# EAGLE design multiboard (EAGLE 6.3)
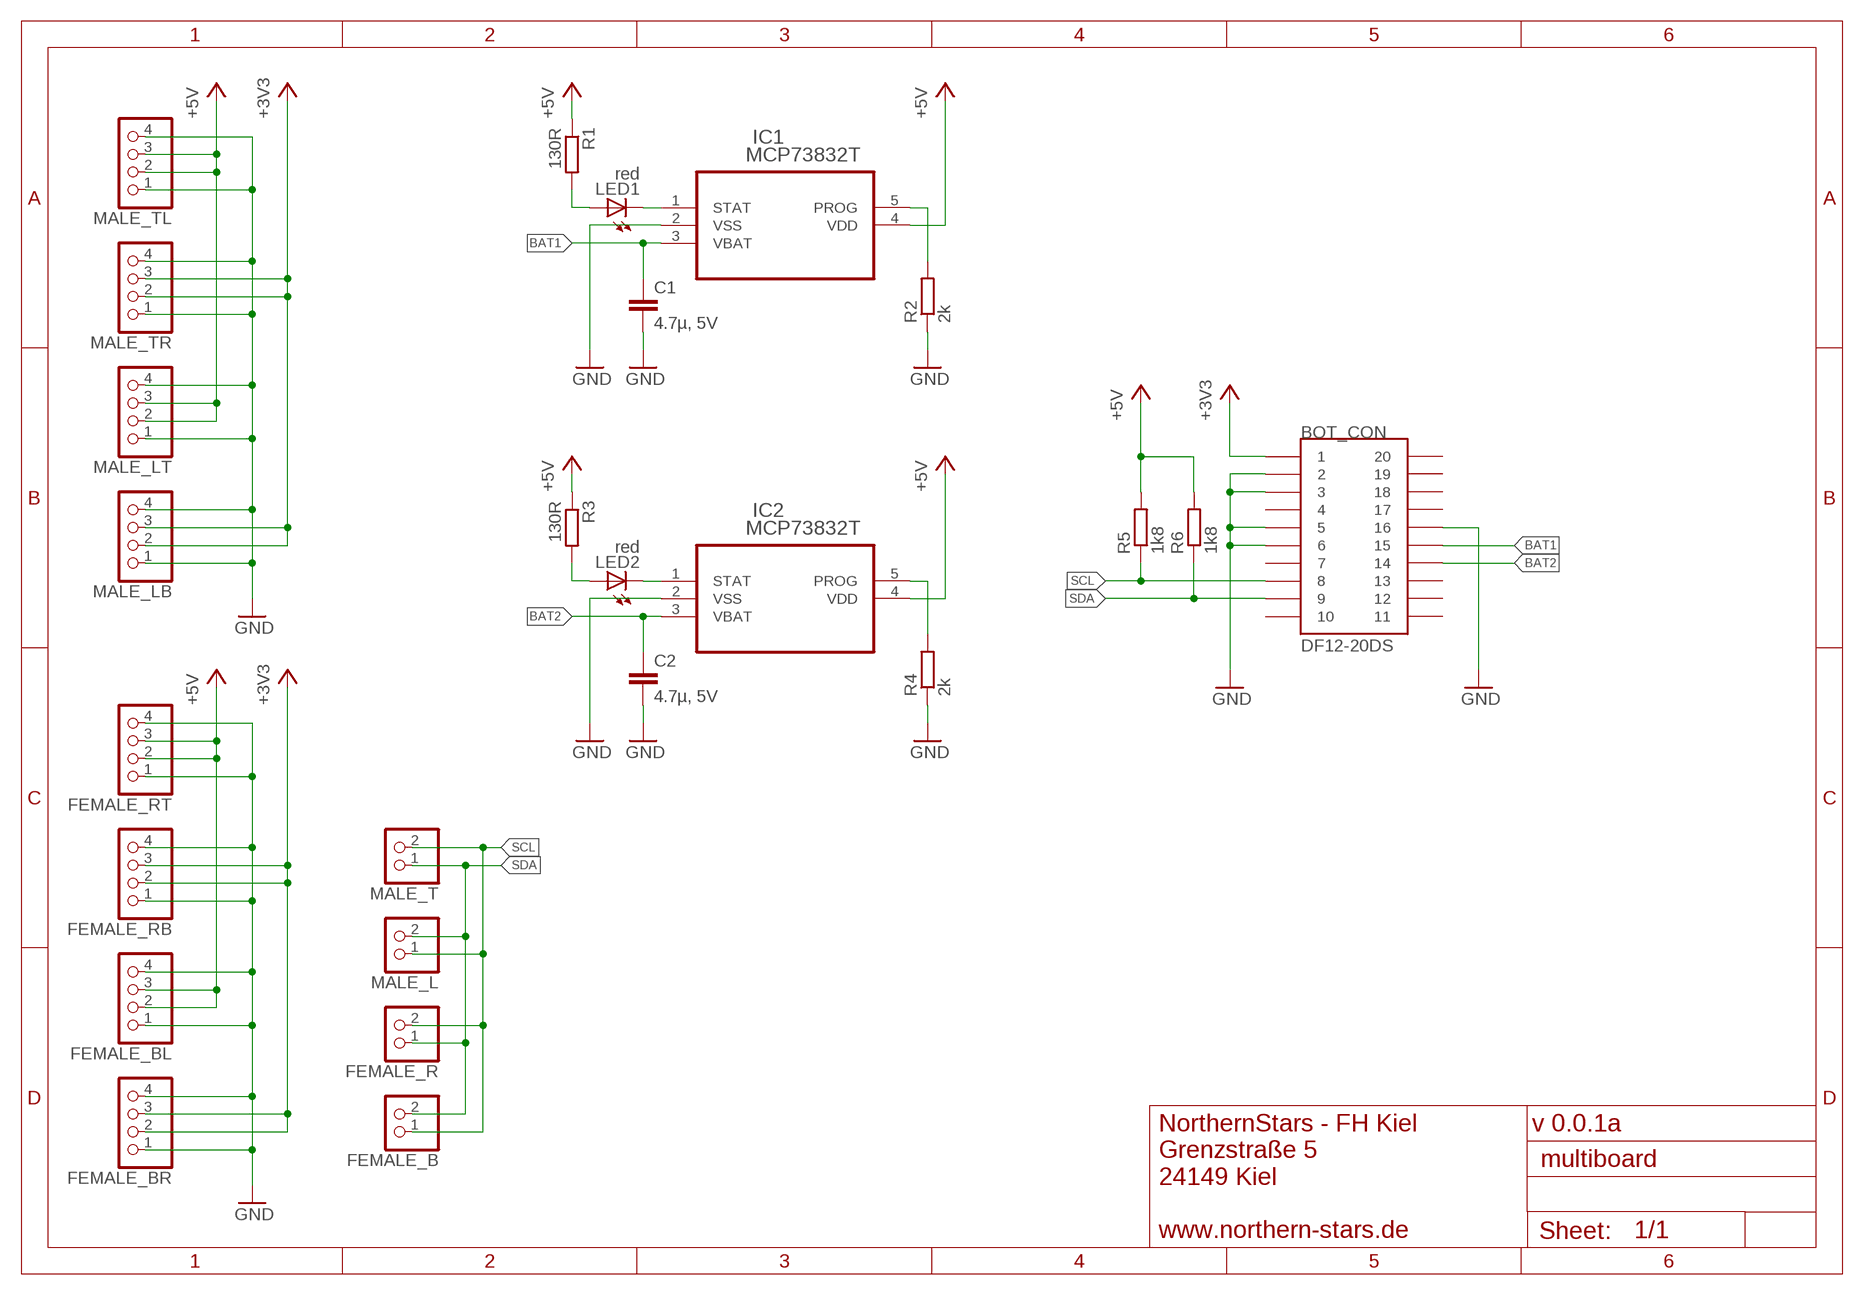
[diagram p0: schematic, sheet 1]

## Parts
BOT_CON  DF12-20DS  [DF12-20DS]
C1  4.7µ, 5V  C-EUC1206  [C1206]
C2  4.7µ, 5V  C-EUC1206  [C1206]
FEMALE_B  PINHD-1X02_2.54-SMD-90°  [1X02SMD/90]
FEMALE_BL  PINHD-1X04_2.54-SMD-90°  [1X04SMD/90]
FEMALE_BR  PINHD-1X04_2.54-SMD-90°  [1X04SMD/90]
FEMALE_R  PINHD-1X02_2.54-SMD-90°  [1X02SMD/90]
FEMALE_RB  PINHD-1X04_2.54-SMD-90°  [1X04SMD/90]
FEMALE_RT  PINHD-1X04_2.54-SMD-90°  [1X04SMD/90]
IC1  MCP73832T  MCP73832T-2DCI/OT  [SOT95P300X145-5N]
IC2  MCP73832T  MCP73832T-2DCI/OT  [SOT95P300X145-5N]
LED1  red  LEDCHIPLED_1206  [CHIPLED_1206]
LED2  red  LEDCHIPLED_1206  [CHIPLED_1206]
MALE_L  PINHD-1X02_2.54-SMD-90°  [1X02SMD/90]
MALE_LB  PINHD-1X04_2.54-SMD-90°  [1X04SMD/90]
MALE_LT  PINHD-1X04_2.54-SMD-90°  [1X04SMD/90]
MALE_T  PINHD-1X02_2.54-SMD-90°  [1X02SMD/90]
MALE_TL  PINHD-1X04_2.54-SMD-90°  [1X04SMD/90]
MALE_TR  PINHD-1X04_2.54-SMD-90°  [1X04SMD/90]
R1  130R  R-EU_R1206  [R1206]
R2  2k  R-EU_R1206  [R1206]
R3  130R  R-EU_R1206  [R1206]
R4  2k  R-EU_R1206  [R1206]
R5  1k8  R-EU_R1206  [R1206]
R6  1k8  R-EU_R1206  [R1206]

## Nets
+3V3: BOT_CON.1 FEMALE_BR.2 FEMALE_BR.3 FEMALE_RB.2 FEMALE_RB.3 MALE_LB.2 MALE_LB.3 MALE_TR.2 MALE_TR.3
+5V: FEMALE_BL.2 FEMALE_BL.3 FEMALE_RT.2 FEMALE_RT.3 IC1.4(VDD) IC2.4(VDD) MALE_LT.2 MALE_LT.3 MALE_TL.2 MALE_TL.3 R1.1 R3.1 R5.2 R6.2
BAT1: BOT_CON.15 C1.1 IC1.3(VBAT)
BAT2: BOT_CON.14 C2.1 IC2.3(VBAT)
GND: BOT_CON.2 BOT_CON.3 BOT_CON.5 BOT_CON.6 BOT_CON.16 C1.2 C2.2 FEMALE_BL.1 FEMALE_BL.4 FEMALE_BR.1 FEMALE_BR.4 FEMALE_RB.1 FEMALE_RB.4 FEMALE_RT.1 FEMALE_RT.4 IC1.2(VSS) IC2.2(VSS) MALE_LB.1 MALE_LB.4 MALE_LT.1 MALE_LT.4 MALE_TL.1 MALE_TL.4 MALE_TR.1 MALE_TR.4 R2.1 R4.1
N$1: IC1.1(STAT) LED1.C
N$2: LED1.A R1.2
N$3: IC2.1(STAT) LED2.C
N$4: IC1.5(PROG) R2.2
N$5: LED2.A R3.2
N$6: IC2.5(PROG) R4.2
SCL: BOT_CON.8 FEMALE_B.1 FEMALE_R.2 MALE_L.1 MALE_T.2 R5.1
SDA: BOT_CON.9 FEMALE_B.2 FEMALE_R.1 MALE_L.2 MALE_T.1 R6.1
Unconnected: BOT_CON.4 BOT_CON.7 BOT_CON.10 BOT_CON.11 BOT_CON.12 BOT_CON.13 BOT_CON.17 BOT_CON.18 BOT_CON.19 BOT_CON.20

## Notes on the sheet
- v 0.0.1a
- NorthernStars - FH Kiel
  Grenzstraße 5
  24149 Kiel
  
  www.northern-stars.de

## Library data of the parts
BOT_CON = con-hirose:DF12-20: HRS-Hirose DF12-Series 0.5mm Pitch SMT Board to Board Connector 20 contacts
C1 C2 = rcl:C-EU: CAPACITOR, European symbol
FEMALE_B FEMALE_R MALE_L MALE_T = pinhead-2:PINHD-1X02: PIN HEADER
FEMALE_BL FEMALE_BR FEMALE_RB FEMALE_RT MALE_LB MALE_LT MALE_TL MALE_TR = pinhead-2:PINHD-1X04: PIN HEADER
IC1 IC2 = microchip:MCP73832T-2DCI/OT: IC, BATT CHARGER, Li-Ion Li-Polymer, 500 mA; MPN: MCP73832T-2DCI/OT; OC_FARNELL: 1834892; OC_NEWARK: 84R5198; PACKAGE: SOT23-5; SUPPLIER: Microchip
LED1 LED2 = led:LED: LED OSRAM: - CHIPLED LG R971, LG N971, LY N971, LG Q971, LY Q971, LO R971, LY R971 LH N974, LH R974 LS Q976, LO Q976, LY Q976 LO Q996 - Hyper CHIPLED LW Q18S LB Q993, LB Q99A, LB R99A - SideLED LS A670, LO A670, LY A670, LG A670, LP A670 LB A673, LV A673, LT A673, LW A673 LH A674 LY A675 LS A676, LA A676, LO A676, LY A676, LW A676 LS A679, LY A679, LG A679 - Hyper Micro SIDELED® LS Y876, LA Y876, LO Y876, LY Y876 LT Y87S - SmartLED LW L88C, LW L88S LB L89C, LB L89S, LG L890 LS L89K, LO L89K, LY L89K LS L896, LA L896, LO L896, LY L896 - TOPLED LS T670, LO T670, LY T670, LG T670, LP T670 LSG T670, LSP T670, LSY T670, LOP T670, LYG T670 LG T671, LOG T671, LSG T671 LB T673, LV T673, LT T673, LW T673 LH T674 LS T676, LA T676, LO T676, LY T676, LB T676, LH T676, LSB T676, LW T676 LB T67C, LV T67C, LT T67C, LS T67K, LO T67K, LY T67K, LW E67C LS E67B, LA E67B, LO E67B, LY E67B, LB E67C, LV E67C, LT E67C LW T67C LS T679, LY T679, LG T679 LS T770, LO T770, LY T770, LG T770, LP T770 LB T773, LV T773, LT T773, LW T773 LH T774 LS E675, LA E675, LY E675, LS T675 LS T776, LA T776, LO T776, LY T776, LB T776 LHGB T686 LT T68C, LB T68C - Hyper Mini TOPLED® LB M676 - Mini TOPLED Santana® LG M470 LS M47K, LO M47K, LY M47K Source: http://www.osram.convergy.de LUXEON: - LUMILED® LXK2-PW12-R00, LXK2-PW12-S00, LXK2-PW14-U00, LXK2-PW14-V00 LXK2-PM12-R00, LXK2-PM12-S00, LXK2-PM14-U00 LXK2-PE12-Q00, LXK2-PE12-R00, LXK2-PE12-S00, LXK2-PE14-T00, LXK2-PE14-U00 LXK2-PB12-K00, LXK2-PB12-L00, LXK2-PB12-M00, LXK2-PB14-N00, LXK2-PB14-P00, LXK2-PB14-Q00 LXK2-PR12-L00, LXK2-PR12-M00, LXK2-PR14-Q00, LXK2-PR14-R00 LXK2-PD12-Q00, LXK2-PD12-R00, LXK2-PD12-S00 LXK2-PH12-R00, LXK2-PH12-S00 LXK2-PL12-P00, LXK2-PL12-Q00, LXK2-PL12-R00 Source: www.luxeon.com KINGBRIGHT: KA-3528ASYC Source: www.kingbright.com
R1-R6 = rcl:R-EU_: RESISTOR, European symbol

## Board
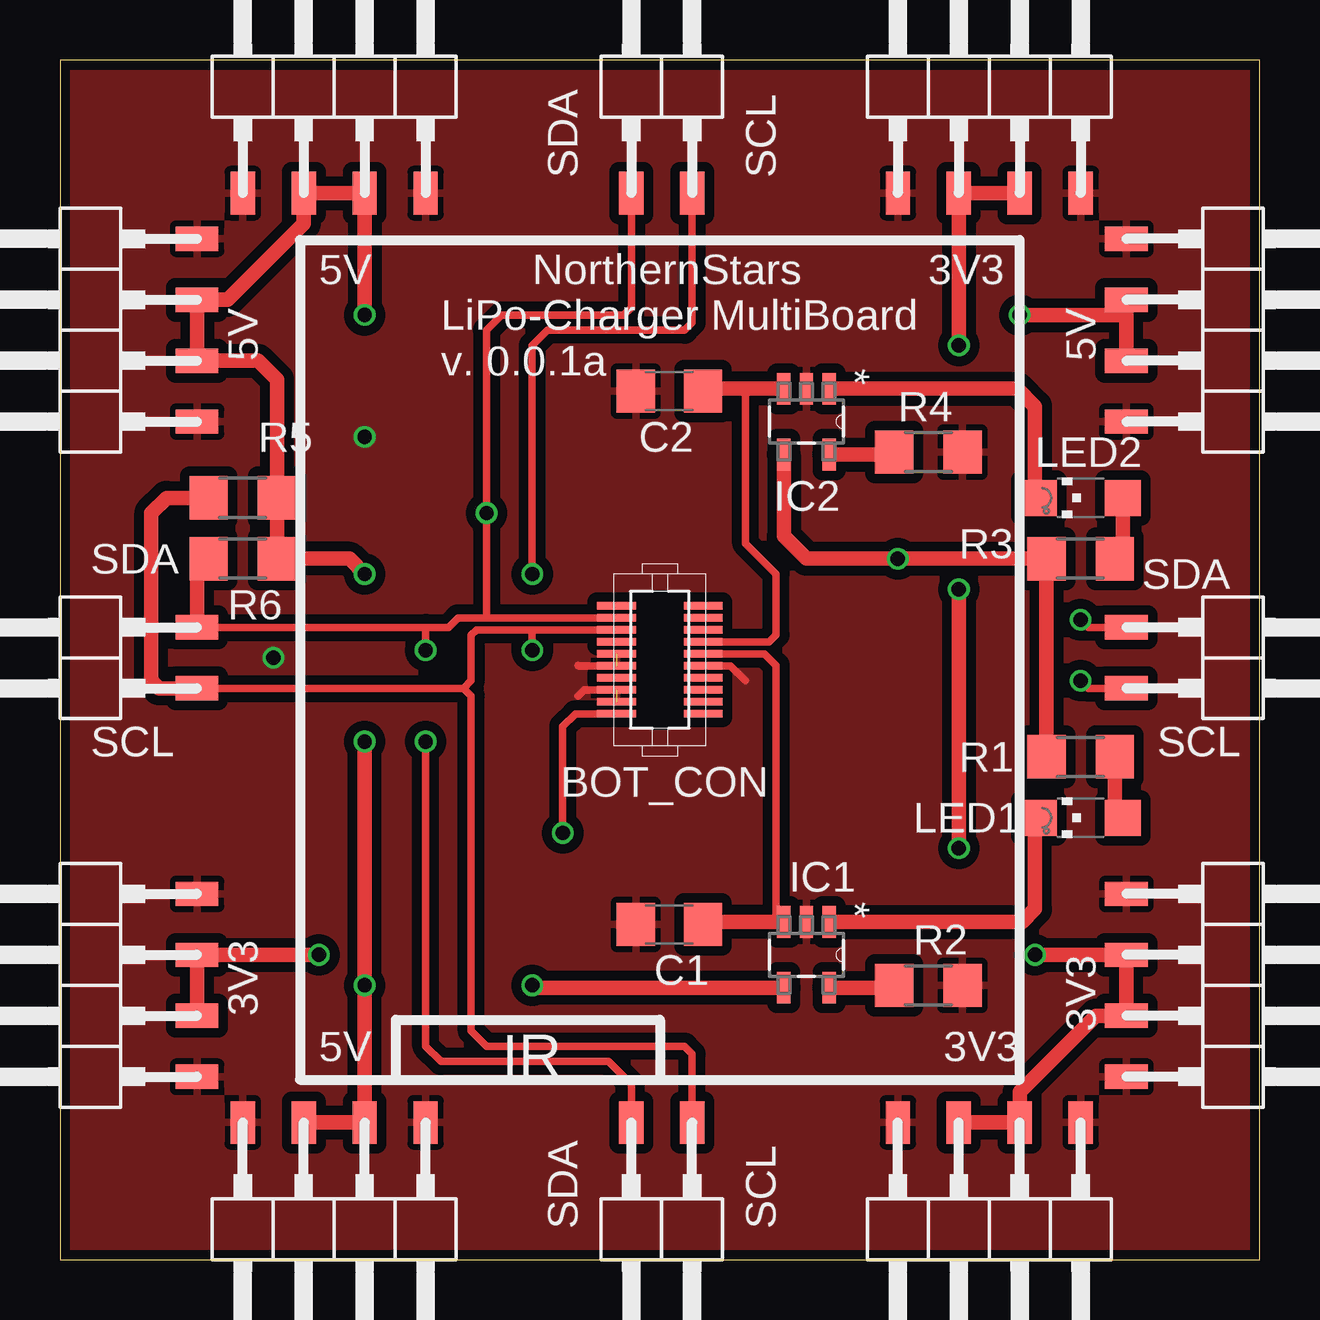
[diagram p1: board, top side]
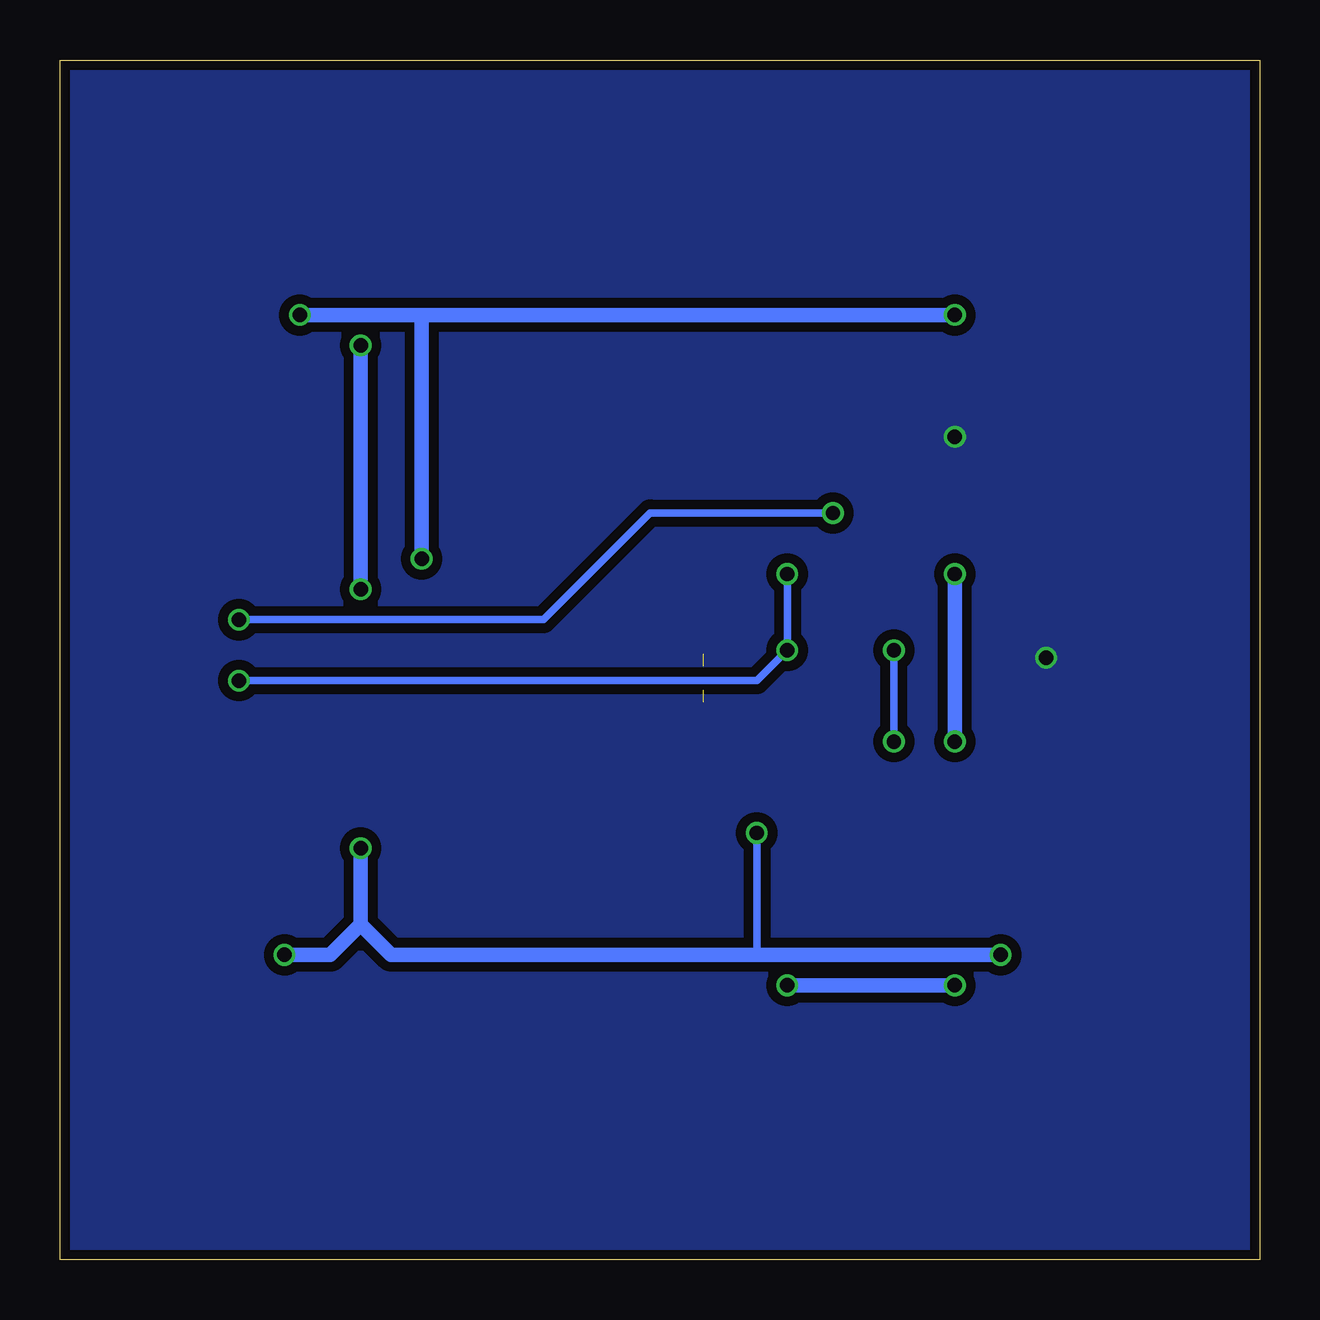
[diagram p2: board, bottom side, seen from below]

Size 50 x 50 mm. Coordinates in mm from the lower left corner, seen from the top.
Outline: 0,0 50,0 50,50 0,50 0,0
Copper layers (1*16): Top 0.035mm / dielectric 1.5mm / Bottom 0.035mm
Design rules "dirt_cheap_dirty_boards.v1": minimum track width 5mil, minimum drill 12mil, track to track 5mil, track to pad 5mil, pad to pad 5mil, via to via 5mil, smd to smd 0mil, copper to edge 10mil, drill to drill 10mil, minimum pad ring 10mil, minimum via ring 6mil, stop-mask expansion 2mil, vias tented up to drill 25mil, thermal gap 10mil

### Footprints (pad centres in the part's own frame; a part is rotated, then mirrored left to right if it is on the bottom)
DF12-20DS = smd 0.32 x 1.62: 1 -2.25,1.81; 2 -1.75,1.81; 3 -1.25,1.81; 4 -0.75,1.81; 5 -0.25,1.81; 6 0.25,1.81; 7 0.75,1.81; 8 1.25,1.81; 9 1.75,1.81; 10 2.25,1.81; 11 2.25,-1.81; 12 1.75,-1.81; 13 1.25,-1.81; 14 0.75,-1.81; 15 0.25,-1.81; 16 -0.25,-1.81; 17 -0.75,-1.81; 18 -1.25,-1.81; 19 -1.75,-1.81; 20 -2.25,-1.81
C1206 = smd 1.6 x 1.8: 1 -1.4,0; 2 1.4,0
1X02SMD/90 = smd 1.016 x 1.778: 1 -1.27,-5.08; 2 1.27,-5.08
1X04SMD/90 = smd 1.016 x 1.778: 1 -1.27,-5.08; 2 1.27,-5.08; 3 3.81,-5.08; 4 6.35,-5.08
SOT95P300X145-5N = smd 1.321 x 0.559: 1 -1.372,0.94; 2 -1.372,0; 3 -1.372,-0.94; 4 1.372,-0.94; 5 1.372,0.94
CHIPLED_1206 = smd 1.5 x 1.5: A 0,-1.75; C 0,1.75
R1206 = smd 1.6 x 1.803: 1 -1.422,0; 2 1.422,0

### Placement (x,y rotation side)
BOT_CON  25,25 90 top
C1  25.4,13.97 180 top
C2  25.4,36.2 180 top
FEMALE_B  25.08,0.64 180 top
FEMALE_BL  13.97,0.64 180 top
FEMALE_BR  41.27,0.64 180 top
FEMALE_R  49.53,25.08 270 top
FEMALE_RB  49.53,13.97 270 top
FEMALE_RT  49.53,41.27 270 top
IC1  31.11,12.7 270 top
IC2  31.11,34.92 270 top
LED1  42.55,18.41 90 top
LED2  42.55,31.75 90 top
MALE_L  0.64,25.08 90 top
MALE_LB  0.64,8.89 90 top
MALE_LT  0.64,36.2 90 top
MALE_T  25.08,49.53 0 top
MALE_TL  8.89,49.53 0 top
MALE_TR  36.2,49.53 0 top
R1  42.55,20.95 0 top
R2  36.2,11.43 180 top
R3  42.55,29.21 0 top
R4  36.2,33.66 180 top
R5  7.62,31.75 0 top
R6  7.62,29.21 0 top

### Tracks (layer width: path | path; a pad name or v marks a point on that pad's centre or on a via)
+3V3  (via drill 0.6)
  Top 0.305: BOT_CON.1 21.48,22.75 20.95,22.23 v20.95,17.78
  Top 0.61: MALE_LB.2 MALE_LB.3 v10.79,12.7 | FEMALE_BR.3 FEMALE_BR.2 40.01,6.99 43.18,10.16 FEMALE_RB.3 FEMALE_RB.2 v40.64,12.7 | MALE_TR.3 MALE_TR.2 v37.47,38.1 | v37.47,27.94 v37.47,17.14
  Bottom 0.305: v20.95,17.78 20.95,12.7
  Bottom 0.61: v37.47,38.1 v37.47,27.94 | v37.47,17.14 37.47,13.97 | 37.47,13.97 38.73,12.7 v40.64,12.7 | v10.79,12.7 20.95,12.7 36.2,12.7 37.47,13.97
+5V  (via drill 0.6)
  Top 0.61: IC2.4 30.18,30.15 31.11,29.21 v34.92,29.21 R3.1 R1.1 | FEMALE_BL.3 FEMALE_BL.2 v12.7,11.43 v12.7,21.59 | FEMALE_RT.3 44.45,39.37 | 44.45,39.37 FEMALE_RT.2 | v12.7,39.37 MALE_TL.3 MALE_TL.2 10.16,43.18 6.99,40.01 MALE_LT.3 MALE_LT.2 8.26,37.47 9.04,36.68 R5.2 R6.2 12.06,29.21 v12.7,28.57 | v40.01,39.37 44.45,39.37 | IC1.4 19.79,11.33 v19.68,11.43
  Bottom 0.61: v12.7,39.37 34.92,39.37 | 34.92,39.37 v40.01,39.37 | v12.7,21.59 v12.7,28.57 | 34.92,39.37 v34.92,29.21 | v19.68,11.43 v12.7,11.43
BAT1
  Top 0.305: BOT_CON.15 29.36,25.25 29.84,24.77 29.84,14.4 IC1.3
  Top 0.61: IC1.3 26.9,14.07 C1.1
BAT2
  Top 0.305: BOT_CON.14 29.56,25.75 29.84,26.04 29.84,28.57 28.57,29.84 28.57,36.3
  Top 0.61: IC2.3 28.81,36.3 28.57,36.3 26.8,36.3 C2.1
GND  (via drill 0.6)  (2 unrouted)
  Top 0.305: BOT_CON.5 21.61,24.75 21.59,24.77 | BOT_CON.3 21.84,23.75 21.59,23.5 | BOT_CON.16 27.95,24.75 28.57,24.13
  other vias: 12.7,34.29 8.89,25.08
  pour Top (isolate 0.406): 0,0 0,50.16 50.16,50.16 50.16,0
  pour Bottom (isolate 0.406): 0,0 0,50.16 50.16,50.16 50.16,0
N$1
  Top 0.61: IC1.1 40.11,14.07 40.64,14.61 40.64,18.26 LED1.C
N$2
  Top 0.61: R1.2 43.97,18.74 LED1.A
N$3
  Top 0.61: IC2.1 39.9,36.3 40.64,35.56 40.64,31.91 LED2.C
N$4
  Top 0.61: IC1.5 34.67,11.33 R2.2
N$5
  Top 0.61: LED2.A 44.3,29.54 R3.2
N$6
  Top 0.61: IC2.5 34.67,33.55 R4.2
SCL  (via drill 0.6)
  Top 0.305: MALE_L.1 16.83,23.81 | 16.83,23.81 17.14,24.13 17.14,26.04 17.36,26.25 19.68,26.25 | BOT_CON.8 19.68,26.25 | FEMALE_B.1 26.35,8.57 26.04,8.89 17.78,8.89 17.14,9.53 17.14,23.5 16.83,23.81 | MALE_T.2 26.35,39.05 26.04,38.73 20.32,38.73 19.68,38.1 v19.68,28.57 | v19.68,25.4 19.68,26.25 | FEMALE_R.2 42.86,23.81 v42.55,24.13
  Top 0.61: MALE_L.1 4.13,23.81 3.81,24.13 3.81,31.11 4.45,31.75 R5.1
  Bottom 0.305: v19.68,28.57 v19.68,25.4 20.95,24.13 v42.55,24.13
SDA  (via drill 0.6)
  Top 0.305: BOT_CON.9 17.78,26.75 | 17.78,26.75 16.59,26.75 16.19,26.35 15.24,26.35 | MALE_L.2 15.24,26.35 | FEMALE_B.2 23.81,7.3 22.86,8.26 15.88,8.26 15.24,8.89 v15.24,21.59 | v15.24,25.4 15.24,26.35 | MALE_T.1 23.81,39.69 23.5,39.37 18.41,39.37 17.78,38.73 v17.78,31.11 17.78,30.48 17.78,26.75 | FEMALE_R.1 42.86,26.35 v42.55,26.67
  Top 0.61: MALE_L.2 5.71,28.73 R6.1
  Bottom 0.305: v15.24,21.59 v15.24,25.4 | v42.55,26.67 29.84,26.67 25.4,31.11 v17.78,31.11

### Text on the board
tPlace: NorthernStars | LiPo-Charger MultiBoard | v. 0.0.1a | IR
tNames: SDA | SCL | 5V | 3V3 | 5V | 5V | SDA | SDA | SCL | SCL | 3V3 | 3V3 | 5V | 3V3 | SDA | SCL